# EAGLE schematic Draft0 (EAGLE 9.3.0)

## Sheet 1 of 7: ESP32 + CP2102 + Antenna
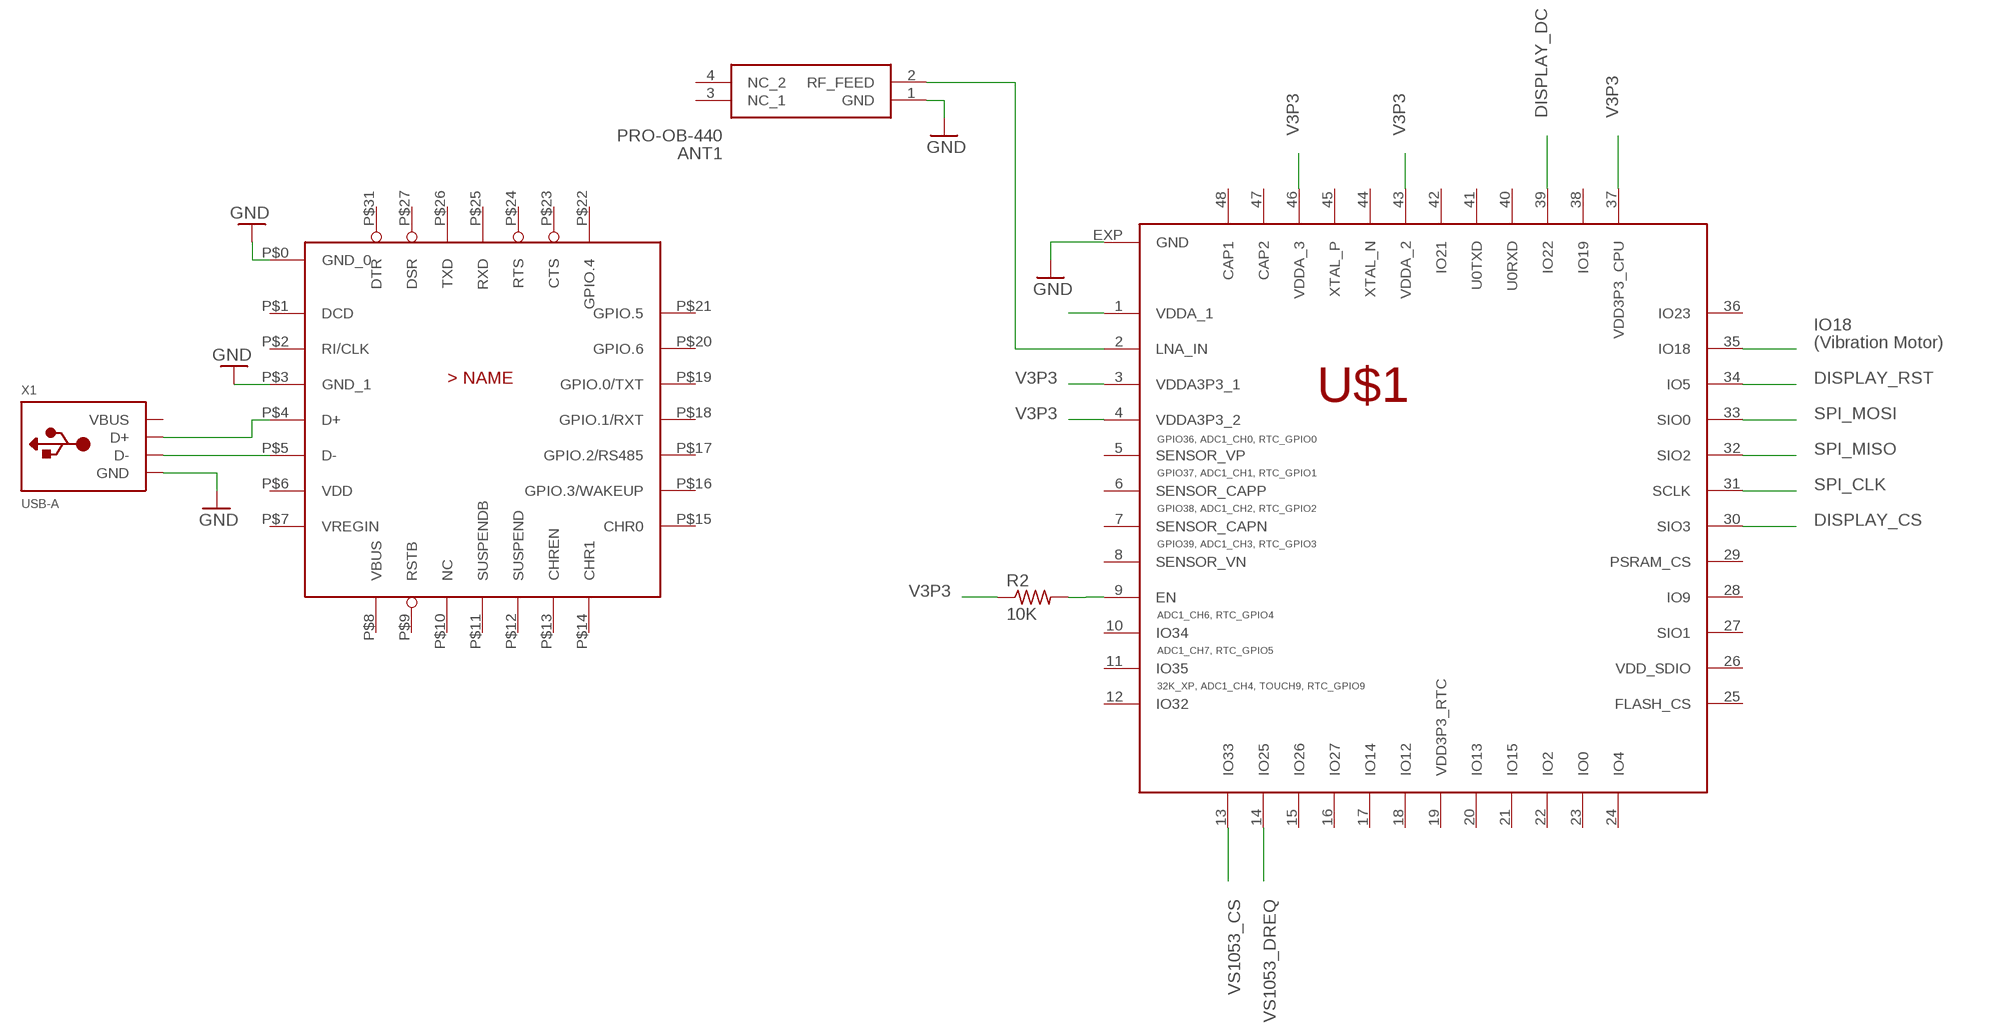
[diagram p0: schematic, sheet 1]

### Parts
ANT1  PRO-OB-440  [PRO-OB-440_1]
R2  10K  R-US_M1206  [M1206]
U$1  ESP32-PICO-D4  [QFN48]
U$4  CP2102N-A02-GQFN28  [QFN28]
X1  USB-A  [MOLEX_480371000]

### Nets
DISPLAY_CS: U$1.30(SIO3)
DISPLAY_DC: U$1.39(IO22)
DISPLAY_RST: U$1.34(IO5)
GND: ANT1.1(GND) U$1.EXP(GND) U$4.P$0(GND_0) U$4.P$3(GND_1) X1.4(GND) ; also sheet 2,3,4,5,6
IO18: U$1.35(IO18) ; also sheet 5
N$1: U$1.1(VDDA_1)
N$5: R2.2 U$1.9(EN)
N$7: ANT1.2(RF_FEED) U$1.2(LNA_IN)
N$11: U$4.P$4(D+) X1.3(D+)
N$12: U$4.P$5(D-) X1.2(D-)
SPI_CLK: U$1.31(SCLK) ; also sheet 3
SPI_MISO: U$1.32(SIO2) ; also sheet 3
SPI_MOSI: U$1.33(SIO0) ; also sheet 3
V3P3: R2.1 U$1.3(VDDA3P3_1) U$1.4(VDDA3P3_2) U$1.37(VDD3P3_CPU) U$1.43(VDDA_2) U$1.46(VDDA_3) ; also sheet 3,4,6
VS1053_CS: U$1.13(IO33) ; also sheet 3
VS1053_DREQ: U$1.14(IO25) ; also sheet 3
Unconnected: ANT1.3(NC_1) ANT1.4(NC_2) U$1.5(SENSOR_VP) U$1.6(SENSOR_CAPP) U$1.7(SENSOR_CAPN) U$1.8(SENSOR_VN) U$1.10(IO34) U$1.11(IO35) U$1.12(IO32) U$1.15(IO26) U$1.16(IO27) U$1.17(IO14) U$1.18(IO12) U$1.20(IO13) U$1.21(IO15) U$1.22(IO2) U$1.23(IO0) U$1.24(IO4) U$1.25(FLASH_CS) U$1.27(SIO1) U$1.28(IO9) U$1.29(PSRAM_CS) U$1.36(IO23) U$1.38(IO19) U$1.40(U0RXD) U$1.41(U0TXD) U$1.42(IO21) U$1.44(XTAL_N) U$1.45(XTAL_P) U$1.47(CAP2) U$1.48(CAP1) U$4.P$1(DCD) U$4.P$2(RI/CLK) U$4.P$8(VBUS) U$4.P$9(RSTB) U$4.P$10(NC) U$4.P$11(SUSPENDB) U$4.P$12(SUSPEND) U$4.P$13(CHREN) U$4.P$14(CHR1) U$4.P$15(CHR0) U$4.P$16(GPIO.3/WAKEUP) U$4.P$17(GPIO.2/RS485) U$4.P$18(GPIO.1/RXT) U$4.P$19(GPIO.0/TXT) U$4.P$20(GPIO.6) U$4.P$21(GPIO.5) U$4.P$22(GPIO.4) U$4.P$23(CTS) U$4.P$24(RTS) U$4.P$25(RXD) U$4.P$26(TXD) U$4.P$27(DSR) U$4.P$31(DTR)

### Notes on the sheet
- (Vibration Motor)

## Sheet 2 of 7: Display
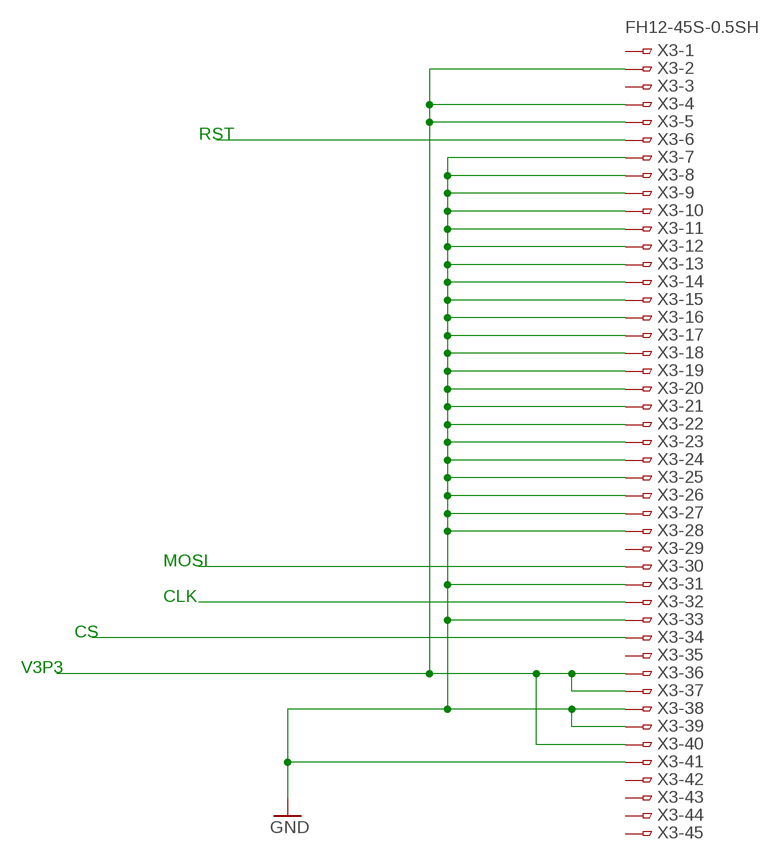
[diagram p1: schematic, sheet 2]

### Parts
X3  FH12-45S-0.5SH  [FH12-45S-0.5SH]

### Nets
GND: X3.7 X3.8 X3.9 X3.10 X3.11 X3.12 X3.13 X3.14 X3.15 X3.16 X3.17 X3.18 X3.19 X3.20 X3.21 X3.22 X3.23 X3.24 X3.25 X3.26 X3.27 X3.28 X3.31 X3.33 X3.38 X3.39 X3.41 ; also sheet 1,3,4,5,6
N$13: X3.2 X3.4 X3.5 X3.36 X3.37 X3.40
N$14: X3.6
N$15: X3.34
N$16: X3.32
N$17: X3.30
Unconnected: X3.1 X3.3 X3.29 X3.35 X3.42 X3.43 X3.44 X3.45

### Notes on the sheet
- RST
- MOSI
- CLK
- CS
- V3P3

## Sheet 3 of 7: VS1053
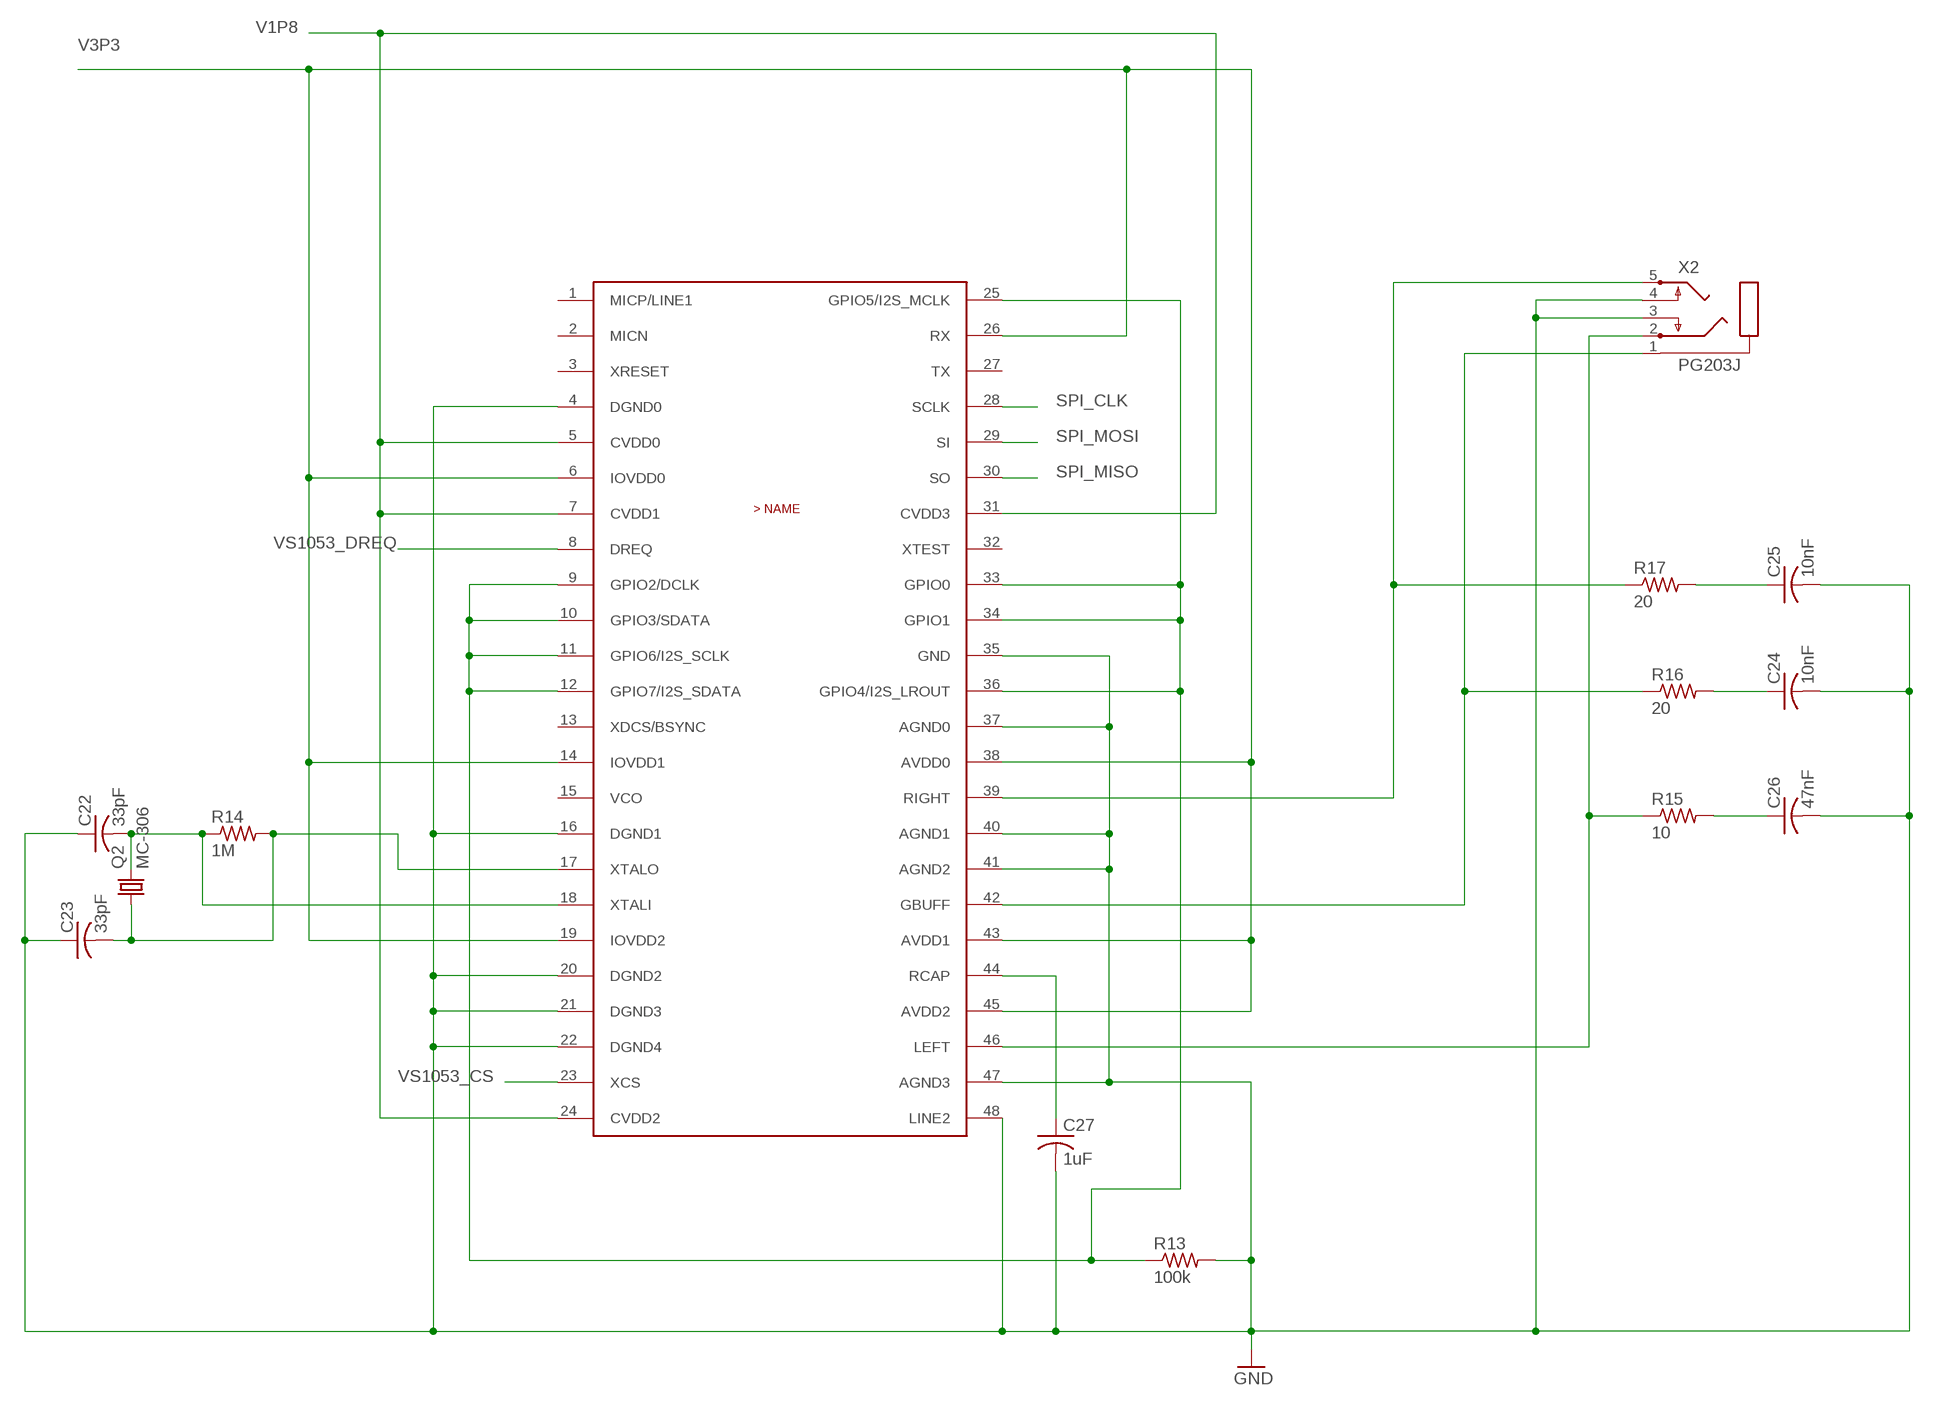
[diagram p2: schematic, sheet 3]

### Parts
C22  33pF  C-USC0402  [C0402]
C23  33pF  C-USC0402  [C0402]
C24  10nF  C-USC0201  [C0201]
C25  10nF  C-USC0201  [C0201]
C26  47nF  C-USC0201  [C0201]
C27  1uF  C-USC0201  [C0201]
Q2  MC-306  [MC-306]
R13  100k  R-US_1812X7R  [1812X7R]
R14  1M  R-US_1812X7R  [1812X7R]
R15  10  R-US_01005  [R01005]
R16  20  R-US_01005  [R01005]
R17  20  R-US_01005  [R01005]
U$7  VS1053  [LQFP48]
X2  PG203J  [PG203J]

### Nets
GND: C22.1 C23.1 C24.2 C25.2 C26.2 C27.2 R13.2 U$7.4(DGND0) U$7.16(DGND1) U$7.20(DGND2) U$7.21(DGND3) U$7.22(DGND4) U$7.35(GND) U$7.37(AGND0) U$7.40(AGND1) U$7.41(AGND2) U$7.47(AGND3) U$7.48(LINE2) X2.3 X2.4 ; also sheet 1,2,4,5,6
N$4: C23.2 Q2.1 R14.2 U$7.17(XTALO)
N$30: R13.1 U$7.9(GPIO2/DCLK) U$7.10(GPIO3/SDATA) U$7.11(GPIO6/I2S_SCLK) U$7.12(GPIO7/I2S_SDATA) U$7.25(GPIO5/I2S_MCLK) U$7.33(GPIO0) U$7.34(GPIO1) U$7.36(GPIO4/I2S_LROUT)
N$31: C22.2 Q2.4 R14.1 U$7.18(XTALI)
N$33: R15.1 U$7.46(LEFT) X2.2
N$34: R16.1 U$7.42(GBUFF) X2.1
N$35: R17.1 U$7.39(RIGHT) X2.5
N$36: C26.1 R15.2
N$37: C24.1 R16.2
N$38: C25.1 R17.2
N$39: C27.1 U$7.44(RCAP)
SPI_CLK: U$7.28(SCLK) ; also sheet 1
SPI_MISO: U$7.30(SO) ; also sheet 1
SPI_MOSI: U$7.29(SI) ; also sheet 1
V1P8: U$7.5(CVDD0) U$7.7(CVDD1) U$7.24(CVDD2) U$7.31(CVDD3) ; also sheet 4
V3P3: U$7.6(IOVDD0) U$7.14(IOVDD1) U$7.19(IOVDD2) U$7.26(RX) U$7.38(AVDD0) U$7.43(AVDD1) U$7.45(AVDD2) ; also sheet 1,4,6
VS1053_CS: U$7.23(XCS) ; also sheet 1
VS1053_DREQ: U$7.8(DREQ) ; also sheet 1
Unconnected: U$7.1(MICP/LINE1) U$7.2(MICN) U$7.3(XRESET) U$7.13(XDCS/BSYNC) U$7.15(VCO) U$7.27(TX) U$7.32(XTEST)

## Sheet 4 of 7: Battery + Regulators
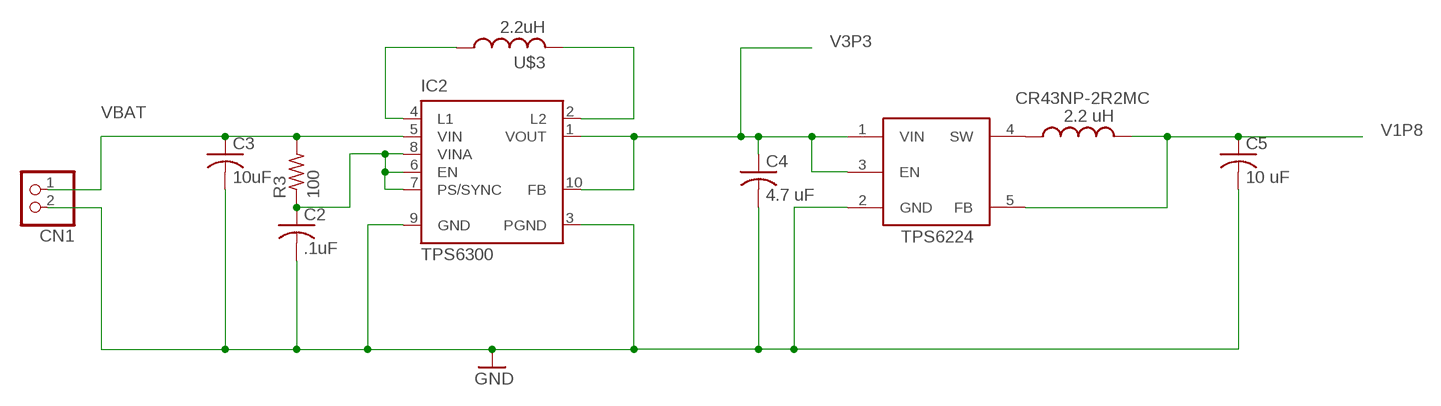
[diagram p3: schematic, sheet 4]

### Parts
C2  .1uF  C-USC0603  [C0603]
C3  10uF  C-USC0603  [C0603]
C4  4.7 uF  C-USC0805  [C0805]
C5  10 uF  C-USC1210  [C1210]
CN1  JST_2PIN-SMT-RA  [JST-PH-2-SMT-RA]
IC2  TPS6300  [DRC-S-PVSON-N10]
R3  100  R-US_01005  [R01005]
TPS6224  TPS62240  [TSP62240]
U$3  2.2uH  VLS4012  [INDUCTOR]
U$5  CR43NP-2R2MC  [INDUCTOR]

### Nets
GND: C2.2 C3.2 C4.2 C5.2 CN1.2 IC2.3(PGND) IC2.9(GND) TPS6224.2(GND) ; also sheet 1,2,3,5,6
N$3: C2.1 IC2.6(EN) IC2.7(PS/SYNC) IC2.8(VINA) R3.1
N$6: IC2.2(L2) U$3.P$2
N$8: IC2.4(L1) U$3.P$1
N$10: TPS6224.4(SW) U$5.P$1
V1P8: C5.1 TPS6224.5(FB) U$5.P$2 ; also sheet 3
V3P3: C4.1 IC2.1(VOUT) IC2.10(FB) TPS6224.1(VIN) TPS6224.3(EN) ; also sheet 1,3,6
VBAT: C3.1 CN1.1 IC2.5(VIN) R3.2 ; also sheet 5
Unconnected: IC2.TH

### Notes on the sheet
- TPS6224

## Sheet 5 of 7: Vibration Motor
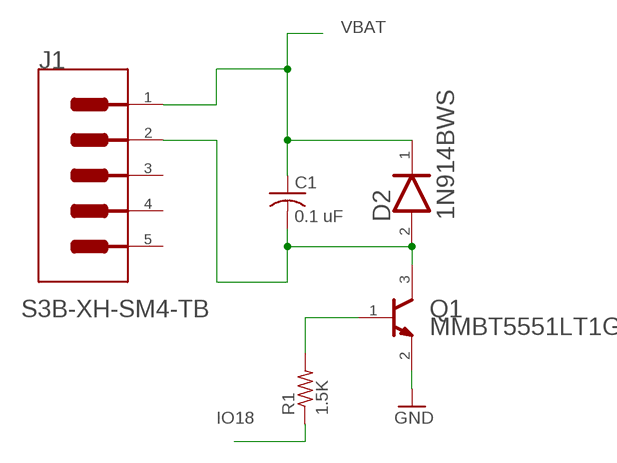
[diagram p4: schematic, sheet 5]

### Parts
C1  0.1 uF  C-US025-024X044  [C025-024X044]
D2  ON_SEMI_1N914BWSON_SEMI_1N914BWS_0_0  [ON_SEMI_1N914BWS_0]
J1  JST_S3B-XH-SM4-TBJST_S3B-XH-SM4-TB_0_0  [JST_S3B-XH-SM4-TB_0]
Q1  ON_SEMI_MMBT5551LT1GON_SEMI_MMBT5551LT1G_0_0  [ON_SEMI_MMBT5551LT1G_0]
R1  1.5K  R-US_R0603  [R0603]

### Nets
GND: Q1.2(EMITTER) ; also sheet 1,2,3,4,6
IO18: R1.1 ; also sheet 1
N$2: Q1.1(BASE) R1.2
N$9: C1.2 D2.2(ANODE) J1.2 Q1.3(COLLECTOR)
VBAT: C1.1 D2.1(CATHODE) J1.1 ; also sheet 4
Unconnected: J1.3 J1.4(MNT_1) J1.5(MNT_2)

## Sheet 6 of 7: Clickwheel
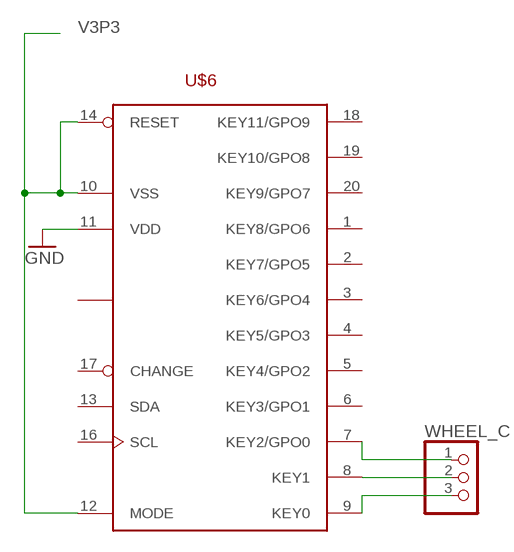
[diagram p5: schematic, sheet 6]

### Parts
U$6  COMMS-AT42QT2120XU  [TSSOP20]
WHEEL_C  PINHD-1X3/90  [1X03/90]

### Nets
GND: U$6.11(VDD) ; also sheet 1,2,3,4,5
N$25: U$6.9(KEY0) WHEEL_C.3
N$26: U$6.8(KEY1) WHEEL_C.2
N$27: U$6.7(KEY2/GPO0) WHEEL_C.1
V3P3: U$6.10(VSS) U$6.12(MODE) U$6.14(RESET) ; also sheet 1,3,4
Unconnected: U$6.1(KEY8/GPO6) U$6.2(KEY7/GPO5) U$6.3(KEY6/GPO4) U$6.4(KEY5/GPO3) U$6.5(KEY4/GPO2) U$6.6(KEY3/GPO1) U$6.13(SDA) U$6.15(NC) U$6.16(SCL) U$6.17(CHANGE) U$6.18(KEY11/GPO9) U$6.19(KEY10/GPO8) U$6.20(KEY9/GPO7)

## Sheet 7 of 7: microSD Card

## Power pins joined to a net without a drawn wire
VBUS: X1.1(VBUS)
VDD: U$4.P$6(VDD)
VDD3P3_RTC: U$1.19(VDD3P3_RTC)
VDD_SDIO: U$1.26(VDD_SDIO)
VREGIN: U$4.P$7(VREGIN)

## Library data of the parts
ANT1 = PRO-OB-440:PRO-OB-440: OnBoard SMD 2400 antenna Source: Datasheet <http://www.proant.se/files/user/Datasheet - OnBoard SMD 2400 MHz rev 2.0.pdf>; DESCRIPTION: OnBoard SMD 2400 antenna; HEIGHT: mm; MANUFACTURER_NAME: Proant AB; MANUFACTURER_PART_NUMBER: PRO-OB-440
C1 = adafruit:C-US: CAPACITOR, American symbol
C2-C5 C22-C27 = rcl:C-US: CAPACITOR, American symbol; SPICEPREFIX: C
CN1 = adafruit:JST_2PIN: JST 2-Pin Connectors of various flavors SMT-RA (S2B-PH-SM4) 4UConnector #17311 SMT (B2B-PH-SM4) THM-RA (S2B-PH) THM (B2B-PH)
D2 = ON Semi - 1N914BWS:ON_SEMI_1N914BWS: Diode Standard 75V 150mA Surface Mount SOD-323F; CENTROID_NOT_SPECIFIED: No; CURRENT_-_AVERAGE_RECTIFIED_(IO): 150mA; DATASHEET: https://www.fairchildsemi.com/datasheets/1N/1N914BWS.pdf; DIGIKEY_DESCRIPTION: Diode Standard 75V 150mA Surface Mount SOD-323F; DIGIKEY_PART_NUMBER: 1N914BWSCT-ND; LEAD_FREE: yes; MF: ON Semi; MOUSER_PART_NUMBER: 512-1N914BWS; MPN: 1N914BWS; PACKAGE: SOD-323F2L; PREFIX: D; ROHS: yes; TEMPERATURE_RANGE_HIGH: +150°C; VOLTAGE_-_DC_REVERSE_(VR)_(MAX): 75V
IC2 = texas:TPS6300*: HIGH EFFICIENT SINGLE INDUCTOR BUCK-BOOST CONVERTER WITH 1.8-A SWITCHES Source: http://focus.ti.com/lit/ds/symlink/tps63001.pdf; MPN: TPS63000DRCTG4; OC_FARNELL: 1511852; OC_NEWARK: 59M7217
J1 = JST-S3B-XH-SM4-TB:JST_S3B-XH-SM4-TB: 2.5mm pitch/ Disconnectable Crimp style connectors; CENTROID_NOT_SPECIFIED: No; CURRENT: 3.0A; DATASHEET: https://upverter.com/datasheet/d0ef474b08262649b2e88d8de799d1feabfec59e.pdf; DIGIKEY_DESCRIPTION: CONN HEADER XH SMD 3POS 2.5MM; DIGIKEY_PART_NUMBER: 455-2263-1-ND; IMPORTED_FROM: octopart; LEAD_FREE: yes; MF: JST; MPN: S3B-XH-SM4-TB; NUM_PINS: 3; OCTOPART_PART_NUMBER: a0e069d6672e7f27; PACKAGE: HDR3; PREFIX: J; ROHS: yes; TEMPERATURE_RANGE_HIGH: +85°C; TEMPERATURE_RANGE_LOW: -25°C; VOLTAGE: 250V
Q1 = ON Semi - MMBT5551LT1G:ON_SEMI_MMBT5551LT1G: Trans GP BJT NPN 160V 0.06A Automotive 3-Pin SOT-23 T/R; 3DS_PART_NUMBER: 452-00001; CENTROID_NOT_SPECIFIED: No; COLLECTOR_BASE_VOLTAGE: 180V; COLLECTOR_EMITTER_BREAKDOWN_VOLTAGE: 160V; COLLECTOR_EMITTER_SATURATION_VOLTAGE: 0.2V; COLLECTOR_EMITTER_VOLTAGE: 160V; DATASHEET: http://www.onsemi.com/pub/Collateral/MMBT5550LT1-D.PDF; DEVICE_CLASS_L1: Discrete Semiconductors; DEVICE_CLASS_L2: Transistors; DEVICE_CLASS_L3: BJTs; DIGIKEY_DESCRIPTION: TRANS NPN 160V 0.6A SOT23; DIGIKEY_PART_NUMBER: MMBT5551LT1GOSCT-ND; EMITTER_BASE_VOLTAGE: 6V; FOOTPRINT_PARAMETERS_1: {"fp_type":"SOT23","params":{"N":{"default":"3","long name":"Number of leads","type":"multichoice","short name":"N"},"A":{"nom":1000000,"long name":"Height","min":890000,"max":1110000,"short name":"A","type":"measurement"},"A1":{"nom":60000,"long name":"Package clearance","min":10000,"max":100000,"short name":"A1","type":"measurement"},"A2":{"nom":940000,"long name":"Package height","min":880000,"max":1010000,"short name":"A2","type":"measurement"},"D":{"nom":2900000,"long name":"Package length","min":2800000,"max":3040000,"short name":"D","type":"measurement"},"E":{"nom":2400000,"long name":"Width /w leads","min":2100000,"max":2640000,"short name":"E","type":"measurement"},"E1":{"nom":1300000,"long name":"Package width","min":1200000,"max":1400000,"short name":"E1","type":"measurement"},"B":{"nom":440000,"long name":"Lead width","min":370000,"max":500000,"short name":"B","type":"measurement"},"C":{"nom":140000,"long name":"Lead thickness","min":80000,"max":200000,"short name":"C","type":"measurement"},"L":{"nom":430000,"long name":"Lead foot length","min":300000,"max":550000,"short name":"L","type":"measurement"},"e":{"nom":950000,"long name":"Lead pitch","min":null,"max":null,"short name":"e","type":"measurement"},"PHI":{"nom":false,"long name":"Lead angle","min":0,"max":10000000,"short name":"PHI","type":"measurement"},"offset x":{"nom":0,"long name":"X Center offset","min":null,"max":null,"short name":"offset x","type":"measurement"},"offset y":{"nom":0,"long name":"Y Center offset","min":null,"max":null,"short name":"offset y","type":"measurement"},"LS":{"default":"Rounded rectangle","long name":"Land shape","type":"multichoice","short name":"LS"},"LS1":{"default":"Rectangle","long name":"Land shape (Pin 1)","type":"multichoice","short name":"LS1"},"solder toe":{"nom":550000,"long name":"Solder fillet (toe)","min":null,"max":null,"short name":"solder toe","type":"fixedmeasurement"},"solder heel":{"nom":450000,"long name":"Solder fillet (heel)","min":null,"max":null,"short name":"solder heel","type":"fixedmeasurement"},"solder side":{"nom":50000,"long name":"Solder fillet (side)","min":null,"max":null,"short name":"solder side","type":"fixedmeasurement"},"courtyard":{"nom":500000,"long name":"Courtyard","min":null,"max":null,"short name":"courtyard","type":"fixedmeasurement"},"SF":{"default":"A","long name":"Packing level","type":"multichoiceparent","short name":"SF","help":"http://support.upverter.com/customer/portal/articles/978783-what-is-a-footprint-packing-level","children":["solder toe","solder heel","solder side","courtyard"]}}}; FOOTPRINT_PARAMETERS_2: {"fp_type":"SOT23","params":{"N":{"default":"3","long name":"Number of leads","type":"multichoice","short name":"N"},"A":{"nom":1000000,"long name":"Height","min":890000,"max":1110000,"short name":"A","type":"measurement"},"A1":{"nom":60000,"long name":"Package clearance","min":10000,"max":100000,"short name":"A1","type":"measurement"},"A2":{"nom":940000,"long name":"Package height","min":880000,"max":1010000,"short name":"A2","type":"measurement"},"D":{"nom":2900000,"long name":"Package length","min":2800000,"max":3040000,"short name":"D","type":"measurement"},"E":{"nom":2400000,"long name":"Width /w leads","min":2100000,"max":2640000,"short name":"E","type":"measurement"},"E1":{"nom":1300000,"long name":"Package width","min":1200000,"max":1400000,"short name":"E1","type":"measurement"},"B":{"nom":440000,"long name":"Lead width","min":370000,"max":500000,"short name":"B","type":"measurement"},"C":{"nom":140000,"long name":"Lead thickness","min":80000,"max":200000,"short name":"C","type":"measurement"},"L":{"nom":430000,"long name":"Lead foot length","min":300000,"max":550000,"short name":"L","type":"measurement"},"e":{"nom":950000,"long name":"Lead pitch","min":null,"max":null,"short name":"e","type":"measurement"},"PHI":{"nom":false,"long name":"Lead angle","min":0,"max":10000000,"short name":"PHI","type":"measurement"},"offset x":{"nom":0,"long name":"X Center offset","min":null,"max":null,"short name":"offset x","type":"measurement"},"offset y":{"nom":0,"long name":"Y Center offset","min":null,"max":null,"short name":"offset y","type":"measurement"},"LS":{"default":"Rounded rectangle","long name":"Land shape","type":"multichoice","short name":"LS"},"LS1":{"default":"Rectangle","long name":"Land shape (Pin 1)","type":"multichoice","short name":"LS1"},"solder toe":{"nom":350000,"long name":"Solder fillet (toe)","min":null,"max":null,"short name":"solder toe","type":"fixedmeasurement"},"solder heel":{"nom":350000,"long name":"Solder fillet (heel)","min":null,"max":null,"short name":"solder heel","type":"fixedmeasurement"},"solder side":{"nom":30000,"long name":"Solder fillet (side)","min":null,"max":null,"short name":"solder side","type":"fixedmeasurement"},"courtyard":{"nom":250000,"long name":"Courtyard","min":null,"max":null,"short name":"courtyard","type":"fixedmeasurement"},"SF":{"default":"B","long name":"Packing level","type":"multichoiceparent","short name":"SF","help":"http://support.upverter.com/customer/portal/articles/978783-what-is-a-footprint-packing-level","children":["solder toe","solder heel","solder side","courtyard"]}}}; FOOTPRINT_PARAMETERS_3: {"fp_type":"SOT23","params":{"N":{"default":"3","long name":"Number of leads","type":"multichoice","short name":"N"},"A":{"nom":1000000,"long name":"Height","min":890000,"max":1110000,"short name":"A","type":"measurement"},"A1":{"nom":60000,"long name":"Package clearance","min":10000,"max":100000,"short name":"A1","type":"measurement"},"A2":{"nom":940000,"long name":"Package height","min":880000,"max":1010000,"short name":"A2","type":"measurement"},"D":{"nom":2900000,"long name":"Package length","min":2800000,"max":3040000,"short name":"D","type":"measurement"},"E":{"nom":2400000,"long name":"Width /w leads","min":2100000,"max":2640000,"short name":"E","type":"measurement"},"E1":{"nom":1300000,"long name":"Package width","min":1200000,"max":1400000,"short name":"E1","type":"measurement"},"B":{"nom":440000,"long name":"Lead width","min":370000,"max":500000,"short name":"B","type":"measurement"},"C":{"nom":140000,"long name":"Lead thickness","min":80000,"max":200000,"short name":"C","type":"measurement"},"L":{"nom":430000,"long name":"Lead foot length","min":300000,"max":550000,"short name":"L","type":"measurement"},"e":{"nom":950000,"long name":"Lead pitch","min":null,"max":null,"short name":"e","type":"measurement"},"PHI":{"nom":false,"long name":"Lead angle","min":0,"max":10000000,"short name":"PHI","type":"measurement"},"offset x":{"nom":0,"long name":"X Center offset","min":null,"max":null,"short name":"offset x","type":"measurement"},"offset y":{"nom":0,"long name":"Y Center offset","min":null,"max":null,"short name":"offset y","type":"measurement"},"LS":{"default":"Rounded rectangle","long name":"Land shape","type":"multichoice","short name":"LS"},"LS1":{"default":"Rectangle","long name":"Land shape (Pin 1)","type":"multichoice","short name":"LS1"},"solder toe":{"nom":150000,"long name":"Solder fillet (toe)","min":null,"max":null,"short name":"solder toe","type":"fixedmeasurement"},"solder heel":{"nom":250000,"long name":"Solder fillet (heel)","min":null,"max":null,"short name":"solder heel","type":"fixedmeasurement"},"solder side":{"nom":10000,"long name":"Solder fillet (side)","min":null,"max":null,"short name":"solder side","type":"fixedmeasurement"},"courtyard":{"nom":100000,"long name":"Courtyard","min":null,"max":null,"short name":"courtyard","type":"fixedmeasurement"},"SF":{"default":"C","long name":"Packing level","type":"multichoiceparent","short name":"SF","help":"http://support.upverter.com/customer/portal/articles/978783-what-is-a-footprint-packing-level","children":["solder toe","solder heel","solder side","courtyard"]}}}; FOOTPRINT_URL: http://www.onsemi.com/pub/Collateral/318-08.PDF; FOOTPRINT_VARIANT_NAME_0: Recommended_Land_Pattern; FOOTPRINT_VARIANT_NAME_1: IPC_A; FOOTPRINT_VARIANT_NAME_2: IPC_B; FOOTPRINT_VARIANT_NAME_3: IPC_C; HEIGHT: 1.11mm; HFE_MIN: 80; IPC_LAND_PATTERN_NAME: SOT95P240X100-3; LEAD_FREE: yes; MAX_COLLECTOR_CURRENT: 600mA; MAX_JUNCTION_TEMP: +150°C; MF: ON Semi; MFG_PACKAGE_IDENT: 318-08; MFG_PACKAGE_IDENT_DATE: 01/2018; MFG_PACKAGE_IDENT_REV: AS; MOUSER_PART_NUMBER: 863-MMBT5551LT1G; MPN: MMBT5551LT1G; NUMBER_OF_ELEMENTS: 1; NUMBER_OF_NPN: 1; NUMBER_OF_PNP: 0; PACKAGE: SOT-23 (TO-236); POWER_DISSIPATION: 225mW; PREFIX: Q; ROHS: yes; STANDOFF_HEIGHT: 0.01mm; TEMPERATURE_RANGE_HIGH: +150°C; TEMPERATURE_RANGE_LOW: -55°C; VERIFICATION_VERSION: 0.0.0.1
Q2 = crystal:MC-306: kHz RANGE CRYSTAL UNIT SMD Source: MC-306_405_406_E07X.PDF Homepage <http://www.epsontoyocom.co.jp>; MPN: MC-306 60.0KHZ 100PPM ,12.5PF; OC_FARNELL: 1278040; OC_NEWARK: 31M5576
R1 = adafruit:R-US_: RESISTOR, American symbol
R2 = resistor:R-US_: RESISTOR, American symbol
R3 R13-R17 = rcl:R-US_: RESISTOR, American symbol; SPICEPREFIX: R
TPS6224 = TPS62240:TPS62240
U$1 = ESP32:ESP32-PICO
U$3 = VLF4012:VLS4012
U$4 = CP2102N-A02-GQFN28:CP2102N-A02-GQFN28: CP2102N-A02-GQFN28 as per it's datasheet <https://www.silabs.com/documents/public/data-sheets/cp2102n-datasheet.pdf>.
U$5 = CR43NP-4R7MC:CR43NP-2R2MC
U$6 = AT42QT2120:COMMS-AT42QT2120
U$7 = VS1053:VS1053: Codec for Music player
WHEEL_C = pinhead:PINHD-1X3: PIN HEADER
X1 = adafruit:USB-A: USB type A 'plug' Used for things that can directly connect to a USB port, say USB key
X2 = con-hirschmann:PG203J: MIC/HEADPHONE JACK KS-S stereo microphone/headphone jack PG203JN (Schukat); OC_FARNELL: unknown; OC_NEWARK: unknown
X3 = con-hirose:FH12-45S-0.5S: 0.5mm Pitch Connectors For FPC/FFC Source: Data sheet <http://www.hirose.co.jp/cataloge_hp/e58605370.pdf>; OC_FARNELL: unknown; OC_NEWARK: unknown